# EAGLE design Mailbox Notifier 2.1 (EAGLE 9.1.3)
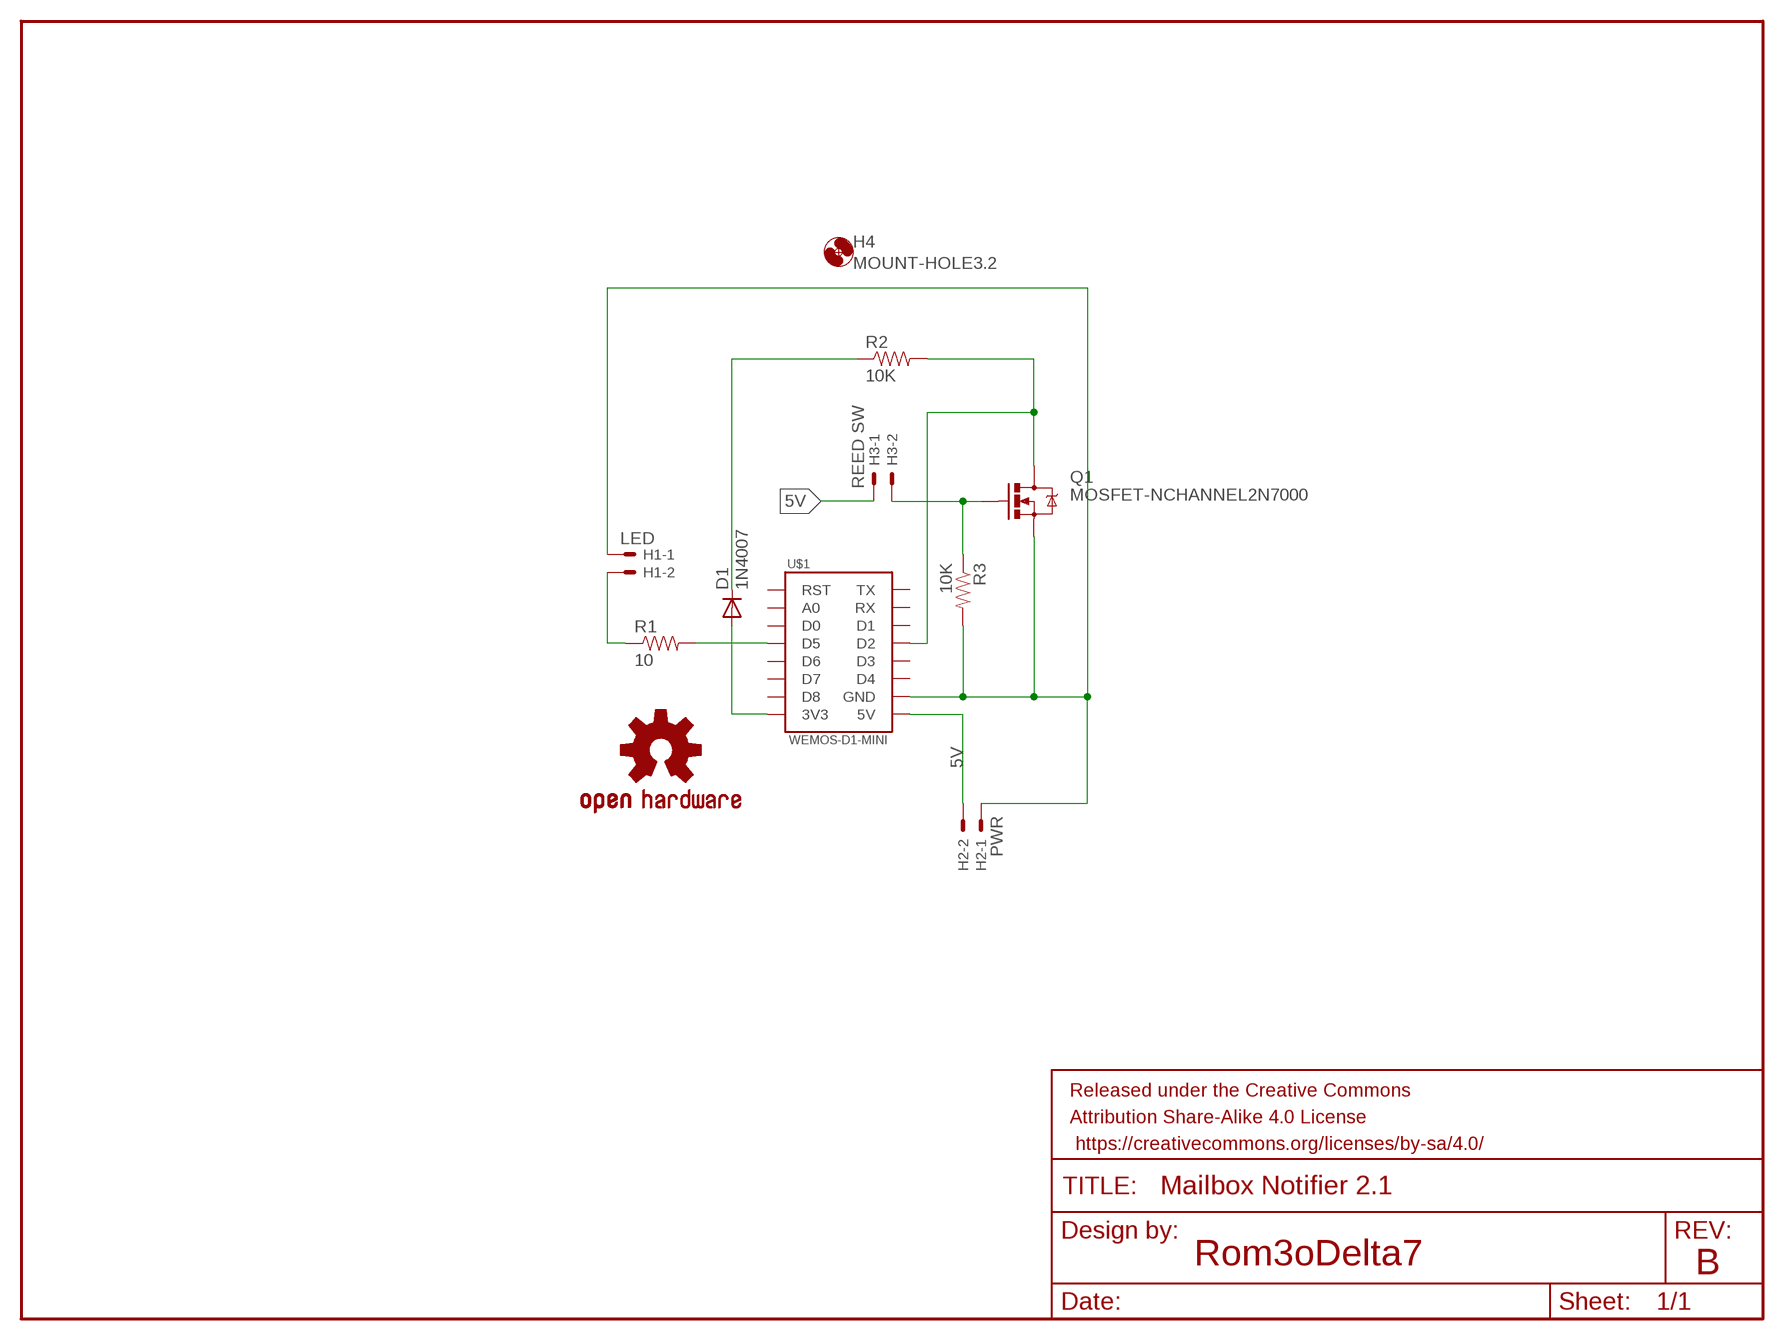
[diagram p0: schematic, sheet 1]

## Parts
D1  1N4007  1N4004  [DO41-10]
FRAME1  FRAME-LETTER  [CREATIVE_COMMONS]
H1  LED  22-23-2021  [22-23-2021]
H2  PWR  22-23-2021  [22-23-2021]
H3  REED SW  22-23-2021  [22-23-2021]
H4  MOUNT-HOLE3.2  [3,2]
LOGO1  OSHW-LOGOMINI  [OSHW-LOGO-MINI]
Q1  MOSFET-NCHANNEL2N7000  [TO-92]
R1  10  RESISTORPTH-1/2W  [AXIAL-0.5]
R2  10K  RESISTORPTH-1/4W  [AXIAL-0.4]
R3  10K  RESISTORPTH-1/4W  [AXIAL-0.4]
U$1  WEMOS-D1-MINI  [WEMOS-D1-MINI]

## Nets
5V [supply]: H2.2 H3.1 U$1.5V
GND [supply]: H1.1 H2.1 Q1.1(S) R3.P$2 U$1.GND
N$1 [supply]: D1.A U$1.3V3
N$2: H3.2 Q1.2(G) R3.P$1
N$3: R1.P$2 U$1.D5
N$4: H1.2 R1.P$1
N$5 [supply]: Q1.3(D) R2.P$2 U$1.D2
N$6 [supply]: D1.C R2.P$1
Unconnected: U$1.A0 U$1.D0 U$1.D1 U$1.D3 U$1.D4 U$1.D6 U$1.D7 U$1.D8 U$1.RST U$1.RX U$1.TX

## Notes on the sheet
- Rom3oDelta7 | B

## Library data of the parts
D1 = diode:1N4004: DIODE general purpose rectifier, 1 A
FRAME1 = SparkFun-Aesthetics:FRAME-LETTER: Schematic Frame Standard 8.5x11 US Letter frame
H1-H3 = con-molex:22-23-2021: .100" (2.54mm) Center Header - 2 Pin; MF: MOLEX; MPN: 22-23-2021; OC_FARNELL: 1462926; OC_NEWARK: 25C3832
H4 = holes:MOUNT-HOLE: MOUNTING HOLE with drill center marker
LOGO1 = SparkFun-Aesthetics:OSHW-LOGO: Open-Source Hardware (OSHW) Logo This logo indicates the piece of hardware it is found on incorporates a OSHW license and/or adheres to the definition of open source hardware found here: http://freedomdefined.org/OSHW
Q1 = RD7Lib:MOSFET-NCHANNEL: Common NMOSFET Parts MFG P/N Store ID Prod ID FDD8780 TRANS-09984 SI7820DN TRANS-11055 FDS6630A IC-08089 2N7002PW TRANS-11151 FQP30N06L COM-10213 TRANS-10060 BSS123LT1G TRANS-08345 BSS138 TRANS-00830 BS170 2N7000
R1-R3 = SparkFun-Passives:RESISTOR: Resistor Basic schematic elements and footprints for 0603, 1206, and PTH resistors.
U$1 = RD7Lib:WEMOS-D1-MINI: WeMOS.cc D1 MINI ESP8266 (ESP-12E) breakout module See http://www.wemos.cc/Products/d1_mini.html

## Net classes
0 default: width 0.305 mm, drill 0.508 mm, clearance 0.254 mm
1 supply: width 0.61 mm, drill 0.889 mm, clearance 0.508 mm

## Board
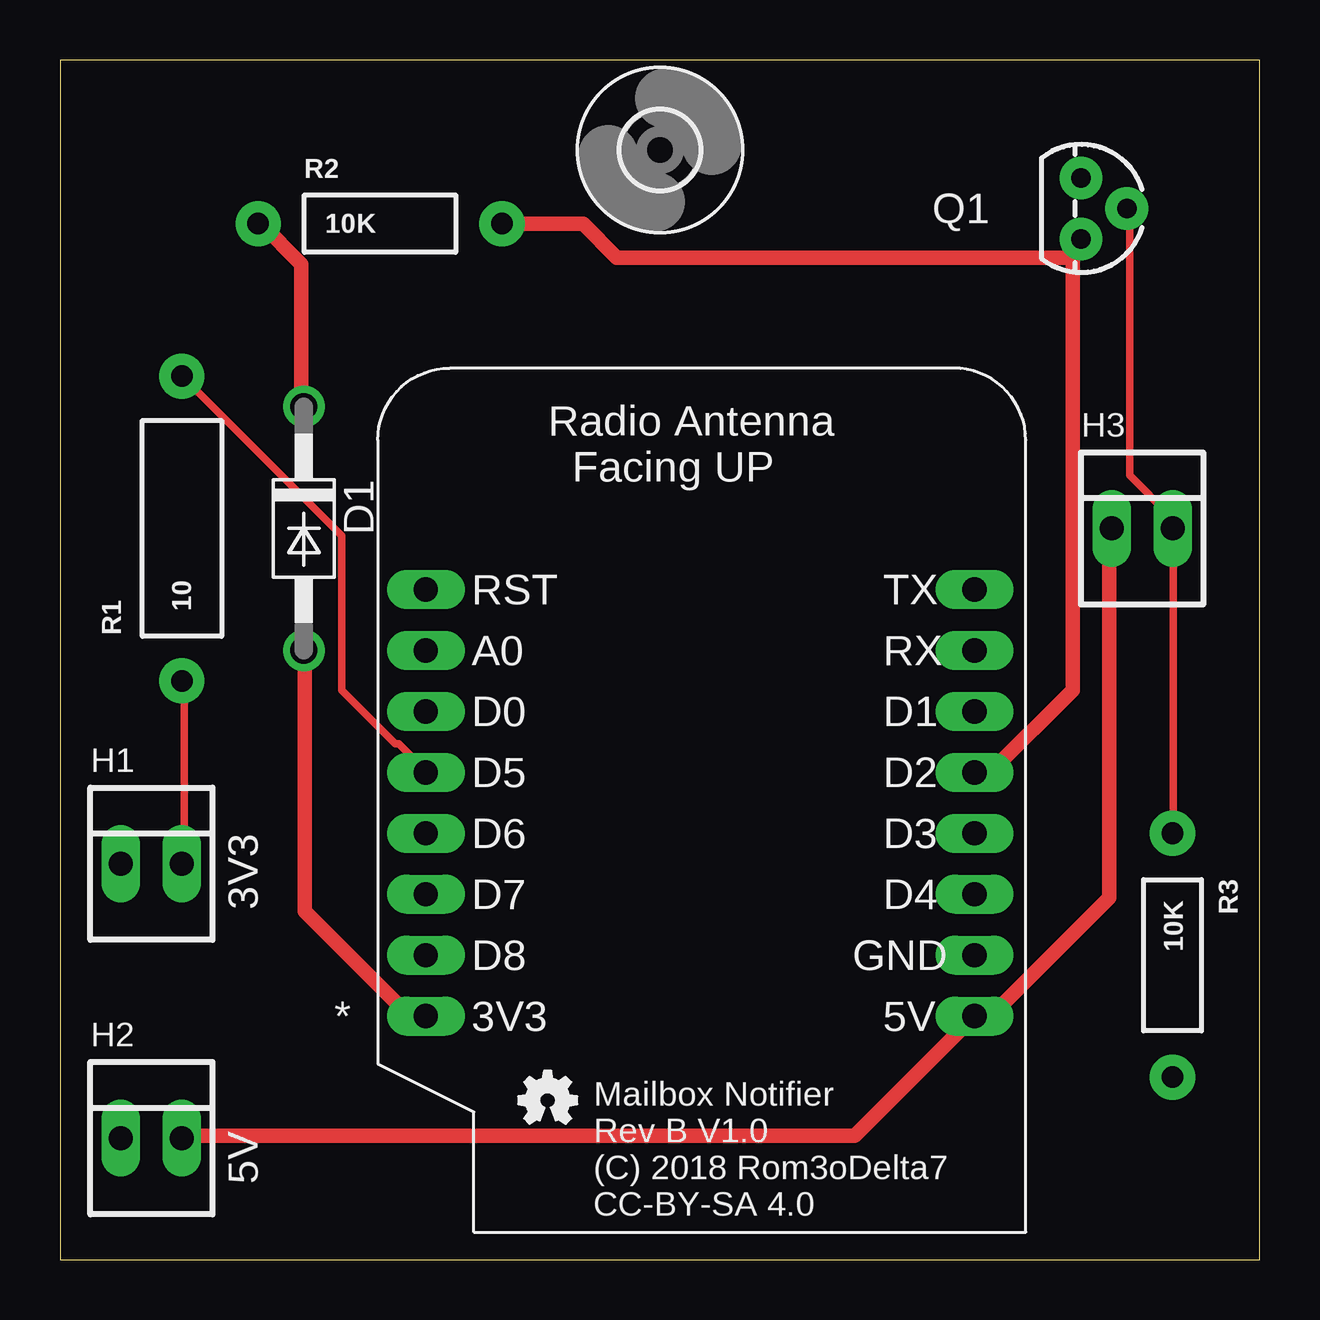
[diagram p1: board, top side]
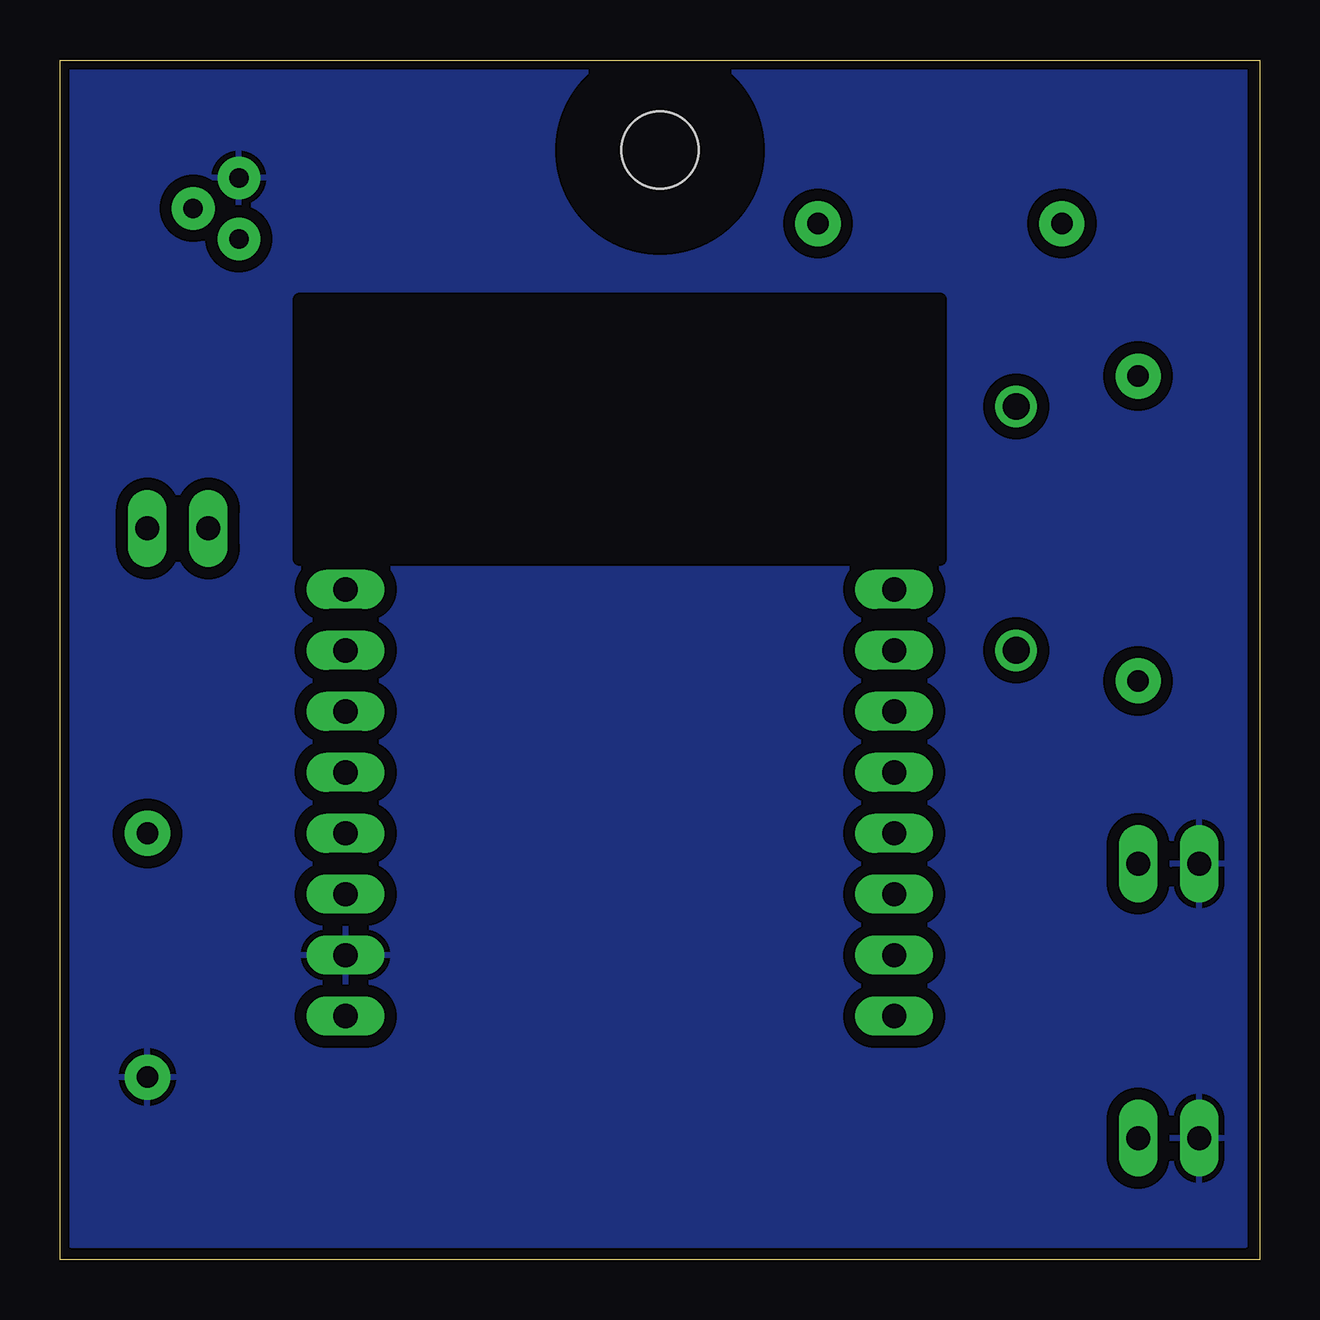
[diagram p2: board, bottom side, seen from below]

Size 50 x 50 mm. Coordinates in mm from the lower left corner, seen from the top.
Outline: 0,0 50,0 50,50 0,50 0,0
Copper layers (1*16): Top 0.035mm / dielectric 1.5mm / Bottom 0.035mm
Design rules "SparkFun-RD7 V2.1": minimum track width 8mil, minimum drill 20mil, track to track 8mil, track to pad 8mil, pad to pad 8mil, via to via 8mil, smd to smd 8mil, copper to edge 15mil, drill to drill 10mil, minimum pad ring 12mil, minimum via ring 10mil, stop-mask expansion 4mil, vias tented up to drill 25mil, thermal gap 10mil
tRestrict: area 13.3,29.2 to 40,40
bRestrict: area 13.3,29.2 to 40,40

### Footprints (pad centres in the part's own frame; a part is rotated, then mirrored left to right if it is on the bottom)
DO41-10 = drill 1.118: A 5.08,0; C -5.08,0
22-23-2021 = drill 1 long: 1 -1.27,0; 2 1.27,0
3,2 = hole 3.2: 0,0
TO-92 = drill 0.813 pad 1.778: 1 -1.27,0; 2 0,1.905; 3 1.27,0
AXIAL-0.5 = drill 0.9 pad 1.88: P$1 -6.35,0; P$2 6.35,0
AXIAL-0.4 = drill 0.9 pad 1.88: P$1 -5.08,0; P$2 5.08,0
WEMOS-D1-MINI = drill 1.016 long: 3V3 0,0; 5V 22.86,0; A0 0,15.24; D0 0,12.7; D1 22.86,12.7; D2 22.86,10.16; D3 22.86,7.62; D4 22.86,5.08; D5 0,10.16; D6 0,7.62; D7 0,5.08; D8 0,2.54; GND 22.86,2.54; RST 0,17.78; RX 22.86,15.24; TX 22.86,17.78

### Placement (x,y rotation side)
D1  10.16,30.48 270 top
FRAME1  -1.27,-11.43 0 top  (outside the outline)
H1  3.81,16.51 0 top
H2  3.81,5.08 0 top
H3  45.09,30.48 0 top
H4  25,46.25 0 top
LOGO1  20.32,6.67 0 top
Q1  42.55,43.81 270 top
R1  5.08,30.48 90 top
R2  13.34,43.18 0 top
R3  46.35,12.7 270 top
U$1  15.24,10.16 0 top

### Tracks (layer width: path | path; a pad name or v marks a point on that pad's centre or on a via)
5V
  Top 0.61: H2.2 5.17,5.17 33.11,5.17 38,10.06 U$1.5V 38.28,10.34 38.98,10.34 43.73,15.09 43.73,30.45 H3.1
GND
  pour Bottom (isolate 0.305): 0.64,49.53 49.53,49.53 49.53,0.64 0.64,0.64
N$1
  Top 0.61: U$1.3V3 15.23,10.2 14.53,10.2 10.2,14.53 10.2,25.29 D1.A
N$2
  Top 0.305: R3.P$1 46.38,17.88 46.38,30.45 H3.2 46.24,30.59 46.24,31.01 44.56,32.69 44.56,43.73 Q1.2
N$3
  Top 0.305: U$1.D5 15.23,20.4 14.11,21.51 13.97,21.51 11.73,23.75 11.73,30.18 5.17,36.74 R1.P$2
N$4
  Top 0.305: H1.2 5.17,16.62 5.17,24.03 R1.P$1
N$5
  Top 0.61: 42.19,41.77 42.19,42.19 42.47,42.47 Q1.3 | 42.19,41.77 42.19,23.75 38.84,20.4 38.14,20.4 U$1.D2 | R2.P$2 18.44,43.17 21.79,43.17 23.19,41.77 41.91,41.77 42.19,41.77
N$6
  Top 0.61: D1.C 10.06,35.62 10.06,41.49 8.38,43.17 R2.P$1

### Text on the board
tPlace: 3V3 | 5V
tNames: Mailbox Notifier / Rev B V1.0 / (C) 2018 Rom3oDelta7 / CC-BY-SA 4.0